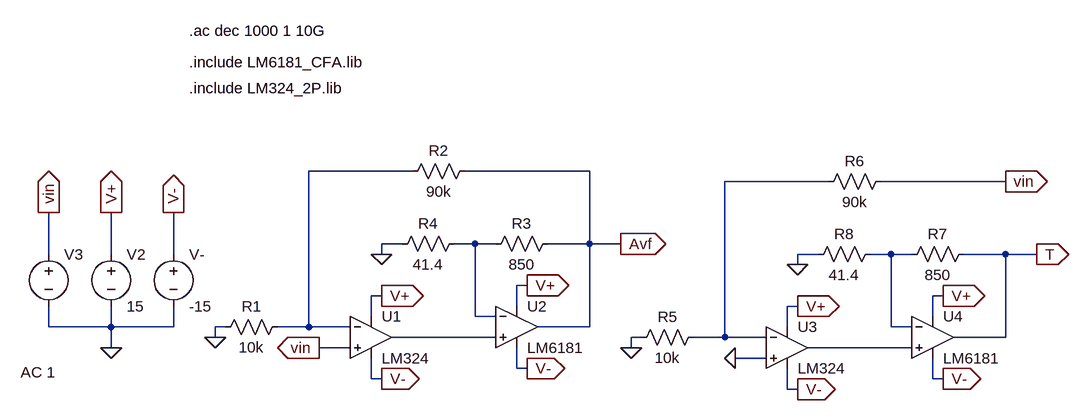
[diagram p0: schematic TP3_C2.asc]
TP3_C2.asc, the LTspice schematic file:
Version 4.1
SHEET 1 2080 760
WIRE 208 -64 48 -64
WIRE 480 -64 288 -64
WIRE 848 -48 688 -48
WIRE 1120 -48 928 -48
WIRE 192 48 160 48
WIRE 304 48 272 48
WIRE 336 48 304 48
WIRE 480 48 480 -64
WIRE 480 48 416 48
WIRE 528 48 480 48
WIRE -352 64 -352 0
WIRE -256 64 -256 0
WIRE -160 64 -160 0
WIRE 160 64 160 48
WIRE 832 64 800 64
WIRE 944 64 912 64
WIRE 976 64 944 64
WIRE 1120 64 1056 64
WIRE 1168 64 1120 64
WIRE 800 80 800 64
WIRE 384 112 368 112
WIRE 160 128 144 128
WIRE 1024 128 1008 128
WIRE 368 144 368 112
WIRE 800 144 784 144
WIRE 144 160 144 128
WIRE 304 160 304 48
WIRE 336 160 304 160
WIRE 1008 160 1008 128
WIRE -352 176 -352 144
WIRE -256 176 -256 144
WIRE -256 176 -352 176
WIRE -160 176 -160 144
WIRE -160 176 -256 176
WIRE -80 176 -96 176
WIRE 48 176 48 -64
WIRE 48 176 0 176
WIRE 112 176 48 176
WIRE 480 176 480 48
WIRE 480 176 400 176
WIRE 784 176 784 144
WIRE 944 176 944 64
WIRE 976 176 944 176
WIRE -96 192 -96 176
WIRE 336 192 176 192
WIRE 560 192 544 192
WIRE 688 192 688 -48
WIRE 688 192 640 192
WIRE 752 192 688 192
WIRE 1120 192 1120 64
WIRE 1120 192 1040 192
WIRE -256 208 -256 176
WIRE 112 208 64 208
WIRE 544 208 544 192
WIRE 976 208 816 208
WIRE 752 224 704 224
WIRE 368 240 368 208
WIRE 384 240 368 240
WIRE 144 256 144 224
WIRE 160 256 144 256
WIRE 1008 256 1008 224
WIRE 1024 256 1008 256
WIRE 784 272 784 240
WIRE 800 272 784 272
FLAG -96 192 0
FLAG 160 64 0
FLAG 528 48 Avf
IOPIN 528 48 Out
FLAG -160 0 V-
IOPIN -160 0 Out
FLAG -256 0 V+
IOPIN -256 0 Out
FLAG -352 0 vin
IOPIN -352 0 Out
FLAG -256 208 0
FLAG 160 256 V-
IOPIN 160 256 Out
FLAG 384 240 V-
IOPIN 384 240 Out
FLAG 160 128 V+
IOPIN 160 128 Out
FLAG 384 112 V+
IOPIN 384 112 Out
FLAG 64 208 vin
IOPIN 64 208 Out
FLAG 544 208 0
FLAG 800 80 0
FLAG 1168 64 T
IOPIN 1168 64 Out
FLAG 800 272 V-
IOPIN 800 272 Out
FLAG 1024 256 V-
IOPIN 1024 256 Out
FLAG 800 144 V+
IOPIN 800 144 Out
FLAG 1024 128 V+
IOPIN 1024 128 Out
FLAG 704 224 0
FLAG 1120 -48 vin
IOPIN 1120 -48 Out
SYMBOL OpAmps\\opamp2 144 128 R0
SYMATTR InstName U1
SYMATTR Value LM324
SYMBOL OpAmps\\opamp2 368 112 R0
SYMATTR InstName U2
SYMATTR Value LM6181
SYMBOL res 16 160 R90
WINDOW 0 0 56 VBottom 2
WINDOW 3 32 56 VTop 2
SYMATTR InstName R1
SYMATTR Value 10k
SYMBOL res 304 -80 R90
WINDOW 0 0 56 VBottom 2
WINDOW 3 32 56 VTop 2
SYMATTR InstName R2
SYMATTR Value 90k
SYMBOL res 432 32 R90
WINDOW 0 0 56 VBottom 2
WINDOW 3 32 56 VTop 2
SYMATTR InstName R3
SYMATTR Value 850
SYMBOL res 288 32 R90
WINDOW 0 0 56 VBottom 2
WINDOW 3 32 56 VTop 2
SYMATTR InstName R4
SYMATTR Value 41.4
SYMBOL voltage -160 48 R0
WINDOW 123 0 0 Left 0
WINDOW 39 0 0 Left 0
SYMATTR InstName V-
SYMATTR Value -15
SYMBOL voltage -256 48 R0
WINDOW 123 0 0 Left 0
WINDOW 39 0 0 Left 0
SYMATTR InstName V2
SYMATTR Value 15
SYMBOL voltage -352 48 R0
WINDOW 3 -43 170 Left 2
WINDOW 123 -43 198 Left 2
WINDOW 39 0 0 Left 0
SYMATTR Value ""
SYMATTR Value2 AC 1
SYMATTR InstName V3
SYMBOL OpAmps\\opamp2 784 144 R0
SYMATTR InstName U3
SYMATTR Value LM324
SYMBOL OpAmps\\opamp2 1008 128 R0
SYMATTR InstName U4
SYMATTR Value LM6181
SYMBOL res 656 176 R90
WINDOW 0 0 56 VBottom 2
WINDOW 3 32 56 VTop 2
SYMATTR InstName R5
SYMATTR Value 10k
SYMBOL res 944 -64 R90
WINDOW 0 0 56 VBottom 2
WINDOW 3 32 56 VTop 2
SYMATTR InstName R6
SYMATTR Value 90k
SYMBOL res 1072 48 R90
WINDOW 0 0 56 VBottom 2
WINDOW 3 32 56 VTop 2
SYMATTR InstName R7
SYMATTR Value 850
SYMBOL res 928 48 R90
WINDOW 0 0 56 VBottom 2
WINDOW 3 32 56 VTop 2
SYMATTR InstName R8
SYMATTR Value 41.4
TEXT -136 -192 Left 2 !.include LM324_2P.lib
TEXT -136 -232 Left 2 !.include LM6181_CFA.lib
TEXT -136 -280 Left 2 !.ac dec 1000 1 10G

The netlist it stands for:
* TP3_C2.asc
X§U1 vin N001 V+ V- N005 LM324  ; pins In+ In- V+ V- OUT
X§U2 N005 N003 V+ V- Avf LM6181  ; pins In+ In- V+ V- OUT
R1 N001 0 10k
R2 Avf N001 90k
R3 Avf N003 850
R4 N003 0 41.4
V- V- 0 -15
V2 V+ 0 15
V3 vin 0 AC 1
X§U3 0 N002 V+ V- N006 LM324  ; pins In+ In- V+ V- OUT
X§U4 N006 N004 V+ V- T LM6181  ; pins In+ In- V+ V- OUT
R5 N002 0 10k
R6 vin N002 90k
R7 T N004 850
R8 N004 0 41.4
.include LM324_2P.lib
.include LM6181_CFA.lib
.ac dec 1000 1 10G
.backanno
.end

* Results of the author's LTspice run, read from the files saved beside the schematic
* Operating Point, zero values left out:
*   V(v+) = 15 V
*   V(v-) = -15 V
*   I(V-) = 60 nA
*   I(V2) = -60 nA
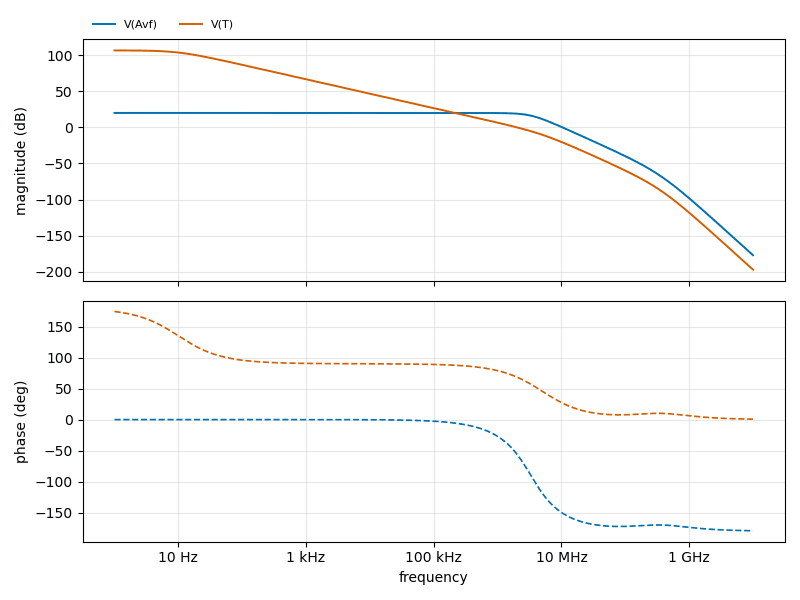
[diagram p1: AC Analysis of TP3_C2.asc, plotted from the saved traces]
* AC Analysis, 1 run:
*   V(Avf): 20.00 dB at 1 Hz, -177.19 dB at 10 GHz, peak 20.00 dB at 1 Hz, 3 dB below the peak at 3.016 MHz
*   V(T): 106.61 dB at 1 Hz, -197.19 dB at 10 GHz, peak 106.61 dB at 1 Hz, 3 dB below the peak at 10.11 Hz